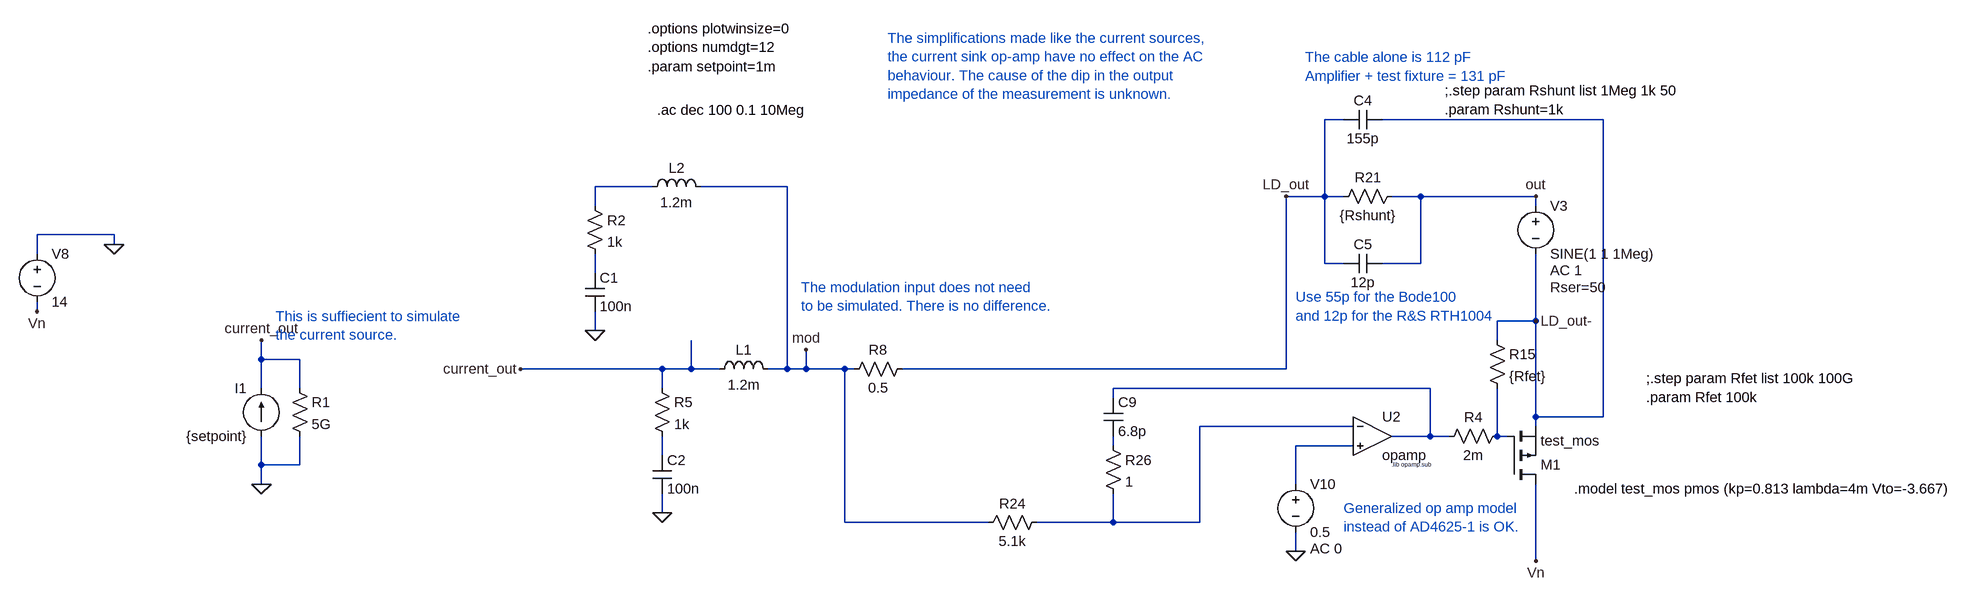
[diagram p0: schematic current_regulator_TIA_simple_output_impedance.asc]
current_regulator_TIA_simple_output_impedance.asc, the LTspice schematic file:
Version 4
SHEET 1 4456 3780
WIRE -112 832 -144 832
WIRE 320 832 -48 832
WIRE -1264 944 -1360 944
WIRE -1040 944 -1184 944
WIRE -144 960 -144 832
WIRE -144 960 -208 960
WIRE -112 960 -144 960
WIRE 16 960 -32 960
WIRE 208 960 16 960
WIRE -1360 976 -1360 944
WIRE 208 976 208 960
WIRE -2480 1024 -2608 1024
WIRE -2480 1040 -2480 1024
WIRE -2608 1056 -2608 1024
WIRE -144 1072 -144 960
WIRE -112 1072 -144 1072
WIRE 16 1072 16 960
WIRE 16 1072 -48 1072
WIRE -1360 1088 -1360 1056
WIRE -2608 1152 -2608 1136
WIRE 208 1168 208 1056
WIRE 208 1168 144 1168
WIRE -1360 1184 -1360 1152
WIRE 144 1200 144 1168
WIRE -2096 1232 -2096 1200
WIRE -2032 1232 -2096 1232
WIRE -1248 1248 -1664 1248
WIRE -1200 1248 -1200 1200
WIRE -1200 1248 -1248 1248
WIRE -1152 1248 -1200 1248
WIRE -1040 1248 -1040 944
WIRE -1040 1248 -1072 1248
WIRE -1008 1248 -1008 1216
WIRE -1008 1248 -1040 1248
WIRE -944 1248 -1008 1248
WIRE -928 1248 -944 1248
WIRE -208 1248 -208 960
WIRE -208 1248 -848 1248
WIRE -2096 1280 -2096 1232
WIRE -2032 1280 -2032 1232
WIRE -1248 1280 -1248 1248
WIRE 32 1280 -496 1280
WIRE -496 1296 -496 1280
WIRE 208 1328 208 1168
WIRE 320 1328 320 832
WIRE 320 1328 208 1328
WIRE -96 1344 -352 1344
WIRE 208 1344 208 1328
WIRE 32 1360 32 1280
WIRE 32 1360 -32 1360
WIRE 64 1360 32 1360
WIRE 144 1360 144 1280
WIRE 160 1360 144 1360
WIRE -496 1376 -496 1360
WIRE -96 1376 -192 1376
WIRE -1248 1392 -1248 1360
WIRE -2096 1408 -2096 1360
WIRE -2032 1408 -2032 1360
WIRE -2032 1408 -2096 1408
WIRE -2096 1440 -2096 1408
WIRE -192 1440 -192 1376
WIRE -1248 1488 -1248 1456
WIRE -944 1504 -944 1248
WIRE -704 1504 -944 1504
WIRE -496 1504 -496 1456
WIRE -496 1504 -624 1504
WIRE -352 1504 -352 1344
WIRE -352 1504 -496 1504
WIRE -192 1552 -192 1520
WIRE 208 1568 208 1440
FLAG -2480 1040 0
FLAG -1664 1248 current_out
FLAG -2608 1152 Vn
FLAG -192 1552 0
FLAG 208 1568 Vn
FLAG 208 960 out
FLAG -208 960 LD_out
FLAG -1248 1488 0
FLAG -1008 1216 mod
FLAG -1360 1184 0
FLAG 208 1168 LD_out-
FLAG -2096 1200 current_out
FLAG -2096 1440 0
SYMBOL voltage -2608 1040 R0
WINDOW 123 0 0 Left 2
WINDOW 39 0 0 Left 2
SYMATTR InstName V8
SYMATTR Value 14
SYMBOL res -832 1232 R90
WINDOW 0 0 56 VBottom 2
WINDOW 3 32 56 VTop 2
SYMATTR InstName R8
SYMATTR Value 0.5
SYMBOL res -16 944 R90
WINDOW 0 0 56 VBottom 2
WINDOW 3 32 56 VTop 2
SYMATTR InstName R21
SYMATTR Value {Rshunt}
SYMBOL voltage -192 1424 R0
WINDOW 123 24 124 Left 2
WINDOW 39 0 0 Left 0
SYMATTR Value2 AC 0
SYMATTR InstName V10
SYMATTR Value 0.5
SYMBOL res -608 1488 R90
WINDOW 0 0 56 VBottom 2
WINDOW 3 32 56 VTop 2
SYMATTR InstName R24
SYMATTR Value 5.1k
SYMBOL cap -512 1296 R0
SYMATTR InstName C9
SYMATTR Value 6.8p
SYMBOL res -512 1360 R0
SYMATTR InstName R26
SYMATTR Value 1
SYMBOL voltage 208 960 R0
WINDOW 123 24 124 Left 2
WINDOW 39 24 152 Left 2
SYMATTR Value2 AC 1
SYMATTR SpiceLine Rser=50
SYMATTR InstName V3
SYMATTR Value SINE(1 1 1Meg)
SYMBOL res 160 1344 R90
WINDOW 0 0 56 VBottom 2
WINDOW 3 32 56 VTop 2
SYMATTR InstName R4
SYMATTR Value 2m
SYMBOL ind -1168 1264 R270
WINDOW 0 32 56 VTop 2
WINDOW 3 5 56 VBottom 2
SYMATTR InstName L1
SYMATTR Value 1.2m
SYMATTR SpiceLine Ipk=1.2 Rser=1.07 Rpar=113040 Cpar=0 mfg="Coilcraft" pn="MSS1210-125"
SYMBOL res -1264 1264 R0
SYMATTR InstName R5
SYMATTR Value 1k
SYMBOL cap -1264 1392 R0
SYMATTR InstName C2
SYMATTR Value 100n
SYMBOL ind -1280 960 R270
WINDOW 0 32 56 VTop 2
WINDOW 3 5 56 VBottom 2
SYMATTR InstName L2
SYMATTR Value 1.2m
SYMATTR SpiceLine Ipk=1.2 Rser=1.07 Rpar=113040 Cpar=0 mfg="Coilcraft" pn="MSS1210-125"
SYMBOL res -1376 960 R0
SYMATTR InstName R2
SYMATTR Value 1k
SYMBOL cap -1376 1088 R0
SYMATTR InstName C1
SYMATTR Value 100n
SYMBOL cap -48 816 R90
WINDOW 0 0 32 VBottom 2
WINDOW 3 32 32 VTop 2
SYMATTR InstName C4
SYMATTR Value 155p
SYMBOL pmos 160 1440 M180
SYMATTR InstName M1
SYMATTR Value test_mos
SYMBOL res 128 1184 R0
SYMATTR InstName R15
SYMATTR Value {Rfet}
SYMBOL cap -48 1056 R90
WINDOW 0 0 32 VBottom 2
WINDOW 3 32 32 VTop 2
SYMATTR InstName C5
SYMATTR Value 12p
SYMBOL OpAmps\\opamp -64 1296 R0
SYMATTR InstName U2
SYMATTR SpiceLine Aol=30Meg
SYMATTR SpiceLine2 GBW=18Meg
SYMBOL current -2096 1360 R180
WINDOW 0 24 80 Left 2
WINDOW 3 24 0 Left 2
WINDOW 123 0 0 Left 0
WINDOW 39 0 0 Left 0
SYMATTR InstName I1
SYMATTR Value {setpoint}
SYMBOL res -2048 1264 R0
SYMATTR InstName R1
SYMATTR Value 5G
TEXT -1272 680 Left 2 !.options plotwinsize=0\n.options numdgt=12
TEXT -1256 816 Left 2 !.ac dec 100 0.1 10Meg
TEXT -1272 744 Left 2 !.param setpoint=1m
TEXT 272 1448 Left 2 !.model test_mos pmos (kp=0.813 lambda=4m Vto=-3.667)
TEXT -32 1408 Left 0 !.lib opamp.sub
TEXT 392 1264 Left 2 !;.step param Rfet list 100k 100G\n.param Rfet 100k
TEXT 56 784 Left 2 !;.step param Rshunt list 1Meg 1k 50\n.param Rshunt=1k
TEXT -176 728 Left 2 ;The cable alone is 112 pF\nAmplifier + test fixture = 131 pF
TEXT -192 1128 Left 2 ;Use 55p for the Bode100\nand 12p for the R&S RTH1004
TEXT -112 1480 Left 2 ;Generalized op amp model\ninstead of AD4625-1 is OK.
TEXT -1016 1112 Left 2 ;The modulation input does not need\nto be simulated. There is no difference.
TEXT -2072 1160 Left 2 ;This is suffiecient to simulate\nthe current source.
TEXT -872 696 Left 2 ;The simplifications made like the current sources,\nthe current sink op-amp have no effect on the AC\nbehaviour. The cause of the dip in the output\nimpedance of the measurement is unknown.

The netlist it stands for:
* current_regulator_TIA_simple_output_impedance.asc
V8 0 Vn 14
R8 LD_out mod 0.5
R21 out LD_out {Rshunt}
V10 N007 0 0.5 AC 0
R24 N004 mod 5.1k
C9 N003 N006 6.8p
R26 N006 N004 1
V3 out LD_out- SINE(1 1 1Meg) AC 1 Rser=50
R4 N005 N003 2m
L1 current_out mod 1.2m Ipk=1.2 Rser=1.07 Rpar=113040 Cpar=0 mfg="Coilcraft" pn="MSS1210-125"
R5 current_out N008 1k
C2 N008 0 100n
L2 N001 mod 1.2m Ipk=1.2 Rser=1.07 Rpar=113040 Cpar=0 mfg="Coilcraft" pn="MSS1210-125"
R2 N001 N002 1k
C1 N002 0 100n
C4 LD_out- LD_out 155p
M1 Vn N005 LD_out- LD_out- test_mos
R15 LD_out- N005 {Rfet}
C5 out LD_out 12p
XU2 N004 N007 N003 opamp Aol=30Meg GBW=18Meg  ; pins invin noninvin out
I1 0 current_out {setpoint}
R1 current_out 0 5G
.model NMOS NMOS
.model PMOS PMOS
.lib standard.mos
.options plotwinsize=0
.options numdgt=12
.ac dec 100 0.1 10Meg
.param setpoint=1m
.model test_mos pmos (kp=0.813 lambda=4m Vto=-3.667)
.lib opamp.sub
;.step param Rfet list 100k 100G
.param Rfet 100k
;.step param Rshunt list 1Meg 1k 50
.param Rshunt=1k
* The cable alone is 112 pF
* Amplifier + test fixture = 131 pF
* Use 55p for the Bode100
* and 12p for the R&S RTH1004
* Generalized op amp model
* instead of AD4625-1 is OK.
* The modulation input does not need
* to be simulated. There is no difference.
* This is suffiecient to simulate
* the current source.
* The simplifications made like the current sources,
* the current sink op-amp have no effect on the AC
* behaviour. The cause of the dip in the output
* impedance of the measurement is unknown.
.backanno
.end